# Altium schematic sheet MCU.SchDoc: Master Controller Unit (MCU)
size 431 x 279 mm; DocumentNumber: BMC-125-5321; Revision: A; SheetNumber: 5; SheetTotal: 6
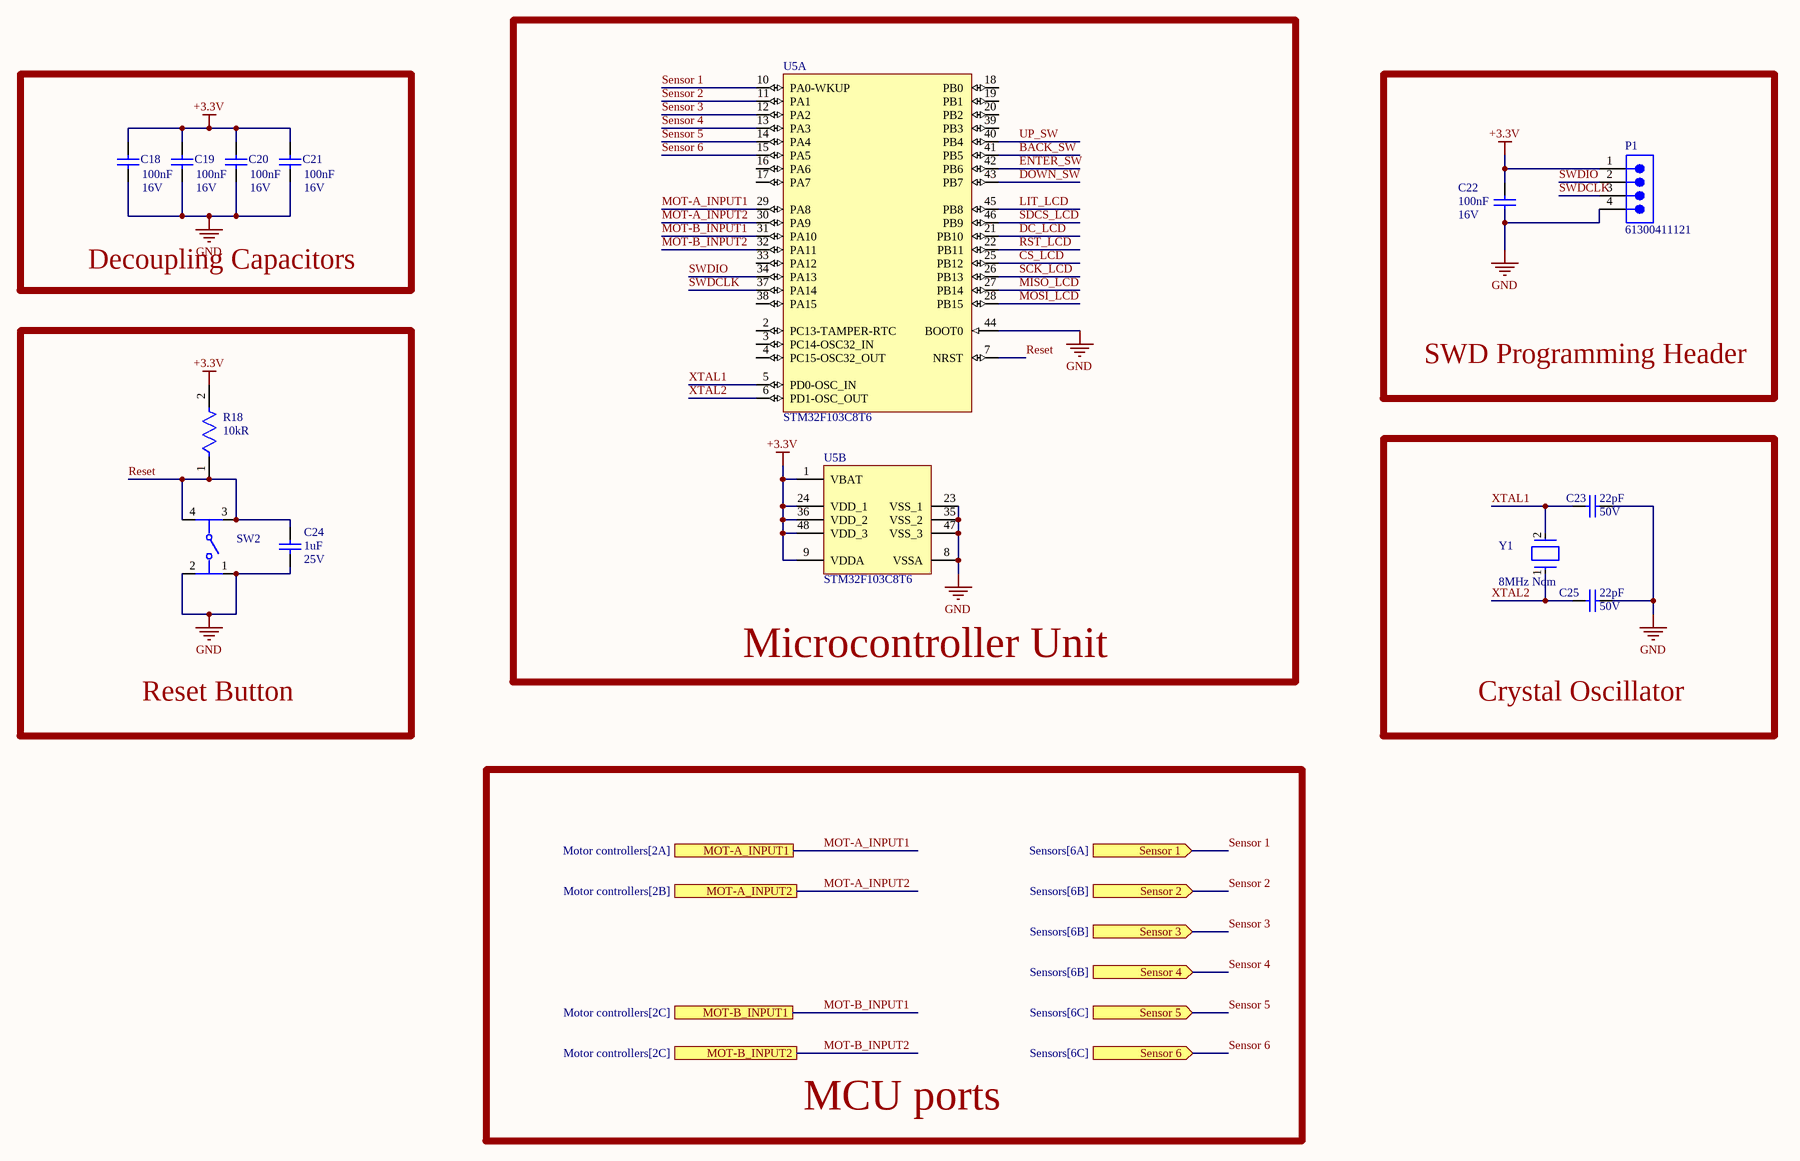
[diagram p0: MCU.SchDoc]

## Parts
C18  value 100nF  Rated DC Voltage (URdc): 16V  [CAPC1608X90X35LL15T15]  (hidden comment: 0.1uF 16V 0603)
C19  value 100nF  Rated DC Voltage (URdc): 16V  [CAPC1608X90X35LL15T15]  (hidden comment: 0.1uF 16V 0603)
C20  value 100nF  Rated DC Voltage (URdc): 16V  [CAPC1608X90X35LL15T15]  (hidden comment: 0.1uF 16V 0603)
C21  value 100nF  Rated DC Voltage (URdc): 16V  [CAPC1608X90X35LL15T15]  (hidden comment: 0.1uF 16V 0603)
C22  value 100nF  Rated DC Voltage (URdc): 16V  [CAPC1608X90X35LL15T15]  (hidden comment: 0.1uF 16V 0603)
C23  value 22pF  Voltage Rating: 50V  [FP-C0603C-CF-IPC_B]  (hidden comment: 22pF 50V 0603)
C24  value 1uF  Rated DC Voltage (URdc): 25V  [FP-CC0603-DA-IPC_B]  (hidden comment: 1uF 25V 0603)
C25  value 22pF  Voltage Rating: 50V  [FP-C0603C-CF-IPC_B]  (hidden comment: 22pF 50V 0603)
P1  61300411121  [61300411121]
R18  value 10kR  [RESC1608X55X25ML10T15]  (hidden comment: 10KOhm 0603)
SW2  PTS645SM43SMTR92LFS  [FP-PTS645SM43SMTR92LFS-MFG]  (value not drawn)
U5  STM32F103C8T6  [STM-LQFP48_M]  (parts A,B of 2)
Y1  ABLS2-8.000MHZ-D4Y-T  [FP-ABLS2-MFG]  (value not drawn)

## Blocks framed on the sheet
Microcontroller Unit: U5
Decoupling Capacitors: C18-C21
SWD Programming Header: C22 P1
Reset Button: C24 R18 SW2
Crystal Oscillator: C23 C25 Y1

## Ports
MOT-A_INPUT1 (see Motor controllers[2A]), MOT-A_INPUT2 (see Motor controllers[2B]), MOT-B_INPUT1 (see Motor controllers[2C]), MOT-B_INPUT2 (see Motor controllers[2C]), Sensor 1 (in, see Sensors[6A]), Sensor 2 (in, see Sensors[6B]), Sensor 3 (in, see Sensors[6B]), Sensor 4 (in, see Sensors[6B]), Sensor 5 (in, see Sensors[6C]), Sensor 6 (in, see Sensors[6C])

## Nets
+3.3V: C18.2 C19.2 C20.2 C21.2 C22.2 P1.1 R18.2 U5.1(VBAT) U5.9(VDDA) U5.24(VDD_1) U5.36(VDD_2) U5.48(VDD_3)
GND: C18.1 C19.1 C20.1 C21.1 C22.1 C23.1 C24.1 C25.1 P1.4 SW2.1 SW2.2 U5.8(VSSA) U5.23(VSS_1) U5.35(VSS_2) U5.44(BOOT0) U5.47(VSS_3)
BACK_SW: U5.41(PB5)
CS_LCD: U5.25(PB12)
DC_LCD: U5.21(PB10)
DOWN_SW: U5.43(PB7)
ENTER_SW: U5.42(PB6)
LIT_LCD: U5.45(PB8)
MISO_LCD: U5.27(PB14)
MOSI_LCD: U5.28(PB15)
MOT-A_INPUT1: U5.29(PA8) ; port MOT-A_INPUT1
MOT-A_INPUT2: U5.30(PA9) ; port MOT-A_INPUT2
MOT-B_INPUT1: U5.31(PA10) ; port MOT-B_INPUT1
MOT-B_INPUT2: U5.32(PA11) ; port MOT-B_INPUT2
Reset: C24.2 R18.1 SW2.3 SW2.4 U5.7(NRST)
RST_LCD: U5.22(PB11)
SCK_LCD: U5.26(PB13)
SDCS_LCD: U5.46(PB9)
Sensor 1: U5.10(PA0-WKUP) ; port Sensor 1
Sensor 2: U5.11(PA1) ; port Sensor 2
Sensor 3: U5.12(PA2) ; port Sensor 3
Sensor 4: U5.13(PA3) ; port Sensor 4
Sensor 5: U5.14(PA4) ; port Sensor 5
Sensor 6: U5.15(PA5) ; port Sensor 6
SWDCLK: P1.3 U5.37(PA14)
SWDIO: P1.2 U5.34(PA13)
UP_SW: U5.40(PB4)
XTAL1: C23.2 U5.5(PD0-OSC_IN) Y1.2
XTAL2: C25.2 U5.6(PD1-OSC_OUT) Y1.1

Not connected (* = marked no-connect by the designer): U5 2(PC13-TAMPER-RTC) 3(PC14-OSC32_IN) 4(PC15-OSC32_OUT) 16(PA6) 17(PA7) 18(PB0) 19(PB1) 20(PB2) 33(PA12) 38(PA15) 39(PB3)

## Notes on the sheet
- MCU ports
- 4
- 3
- DWG NO.
- REV
- 2
- 1
- ALL INFORMATION IN THIS DRAWING IS THE PROPERTY OF EMAC, AND CANNOT BE COPIED OR USED WITHOUT THE WRITTEN APPROVAL OF EMAC.
- D
- C
- B
- 2025 Bright Manufacturing Challenge
- SCHEMATIC
- A
- SIZE
- CODE IDENT
- 0BJZ8
- NONE
- SCALE
- WEIGHT
- NA
- SHEET
- OF
- REV. A, 06/21/2025
- FORM #PDE-0001-0001

## Library data of the parts
C18-C22 = CMP-00000-2: Ceramic Capacitor, Multilayer, Ceramic, 16V, 10% +Tol, 10% -Tol, X7R, 15% TC, 0.1uF, Surface Mount, 0603; Multilayer: Yes; Reference Standard: AEC-Q200; Height: 0.9mm; Capacitor Type: Ceramic; Case/Package: 0603; Dielectric Material: Ceramic; JESD-609 Code: e3; Length: 1.6mm; Max Operating Temperature: 125°C; Min Operating Temperature: -55°C; Mounting Technology: Surface Mount; Package Shape: Rectangular; Package Style: SMTMeter; Packaging: Tape and Reel; Pins: 2; Reach SVHC Compliant: Yes; RoHS Compliant: Yes; Temperature Characteristics Code: X7R; Terminal Finish: Nickel; Termination: Wraparound; Tolerance  (fill in as +-): 10%; Tolerance (fill in as +-): 10%; Width: 0.81mm
C23 C25 = CMP-00009-2: Ceramic Capacitor, Multilayer, Ceramic, 50V, 5% +Tol, 5% -Tol, C0G, 30ppm/Cel TC, 0.000022uF, Surface Mount, 0603; Multilayer: Yes; Height: 0.8mm; Capacitor Type: Ceramic; Case/Package: 0603; Dielectric Material: Ceramic; JESD-609 Code: e3; Length: 1.6mm; Max Operating Temperature: 125°C; Min Operating Temperature: -55°C; Mounting Technology: Surface Mount; Package Shape: Rectangular; Package Style: SMTMeter; Packaging: Tape and Reel; Pins: 2; Rated DC Voltage (URdc): 50V; Reach SVHC Compliant: Yes; RoHS Compliant: Yes; Temperature Characteristics Code: C0G; Terminal Finish: Nickel; Termination: Wraparound; Tolerance  (fill in as +-): 5%; Tolerance (fill in as +-): 5%; Width: 0.8mm
C24 = CMP-00002-5: Ceramic Capacitor, Multilayer, Ceramic, 25V, 10% +Tol, 10% -Tol, X5R, 15% TC, 1uF, Surface Mount, 0603; Multilayer: Yes; Height: 0.8mm; Capacitor Type: Ceramic; Case/Package: 0603; Dielectric Material: Ceramic; JESD-609 Code: e3; Length: 1.6mm; Max Operating Temperature: 85°C; Min Operating Temperature: -55°C; Mounting Technology: Surface Mount; Package Shape: Rectangular; Package Style: SMTMeter; Packaging: Tape and Reel; Pins: 2; Reach SVHC Compliant: Yes; RoHS Compliant: Yes; Temperature Characteristics Code: X5R; Terminal Finish: Nickel; Termination: Wraparound; Tolerance  (fill in as +-): 10%; Tolerance (fill in as +-): 10%; Width: 0.8mm; Voltage Rating: 25V
P1 = CMP-00013-1: Board Connector, 4 Contact(s), 1 Row(s), Male, Straight, 0.1 inch Pitch, Solder Terminal, Locking, Black Insulator, Plug; Contact Resistance: 20mR; Number of Contacts: 4; Body Length: 0.4inch; Contact Pattern: RECTANGULAR; Contact Style: SQ PIN-SKT; Dielectric Withstanding Voltage (AC): 500V; Insulation Resistance: 1GR; Number Of Connectors: 1; Rated Current (Signal): 3A; Reference Standard: UL; Reliability: COMMERCIAL; Termination: Solder; Min Operating Temperature: -40°C; Connector Type: BOARD CONNECTOR; Max Operating Temperature: 125°C; Contact Material: Copper Alloy; Body/Shell Style: PLUG; Body Breadth: 0.1inch; Body Depth: 0.1inch; Contact Finish - Mating: GOLD; Contact Finish - Termination: Gold (Au) - with Nickel (Ni) barrier; Contact Gender: Male; Insulation Color: Black; Insulation Material: Polybutylene; JESD-609 Code: e4; Mating Contact Pitch: 0.1inch; Mounting Option 1: LOCKING; Mounting Style: STRAIGHT; Mounting Technology: Board; Number of Rows Loaded: 1; PCB Contact Pattern: RECTANGULAR; Reach SVHC Compliant: Yes; RoHS Compliant: Yes; Terminal Length: 0.118inch; Terminal Pitch: 2.54mm
R18 = CMP-00018-1: Fixed Resistor, Metal Glaze/thick Film, 0.1W, 10000ohm, 75V, 5% +/-Tol, 100ppm/Cel, Surface Mount, 0603; Additional Feature: LASER TRIMMABLE; Package Height: 0.45mm; Package Length: 1.6mm; Package Width: 0.8mm; Power: 100mW; Rated Temperature: 70°C; Temperature Coefficient (ppm/Cel): 100; Packaging: Tape and Reel; Tolerance: 5%; Case/Package: 0603; Construction: Chip; JESD-609 Code: e3; Max Operating Temperature: 155°C; Min Operating Temperature: -55°C; Mounting Technology: Surface Mount; Package Shape: Rectangular; Pins: 2; Reach SVHC Compliant: Yes; Resistor Type: FIXED RESISTOR; RoHS Compliant: Yes; Technology: METAL GLAZE/THICK FILM; Terminal Finish: Nickel; Termination: Wraparound; Working Voltage: 75V
SW2 = CMP-00020-2: Keypad Switch, 1 Switches, SPST, Momentary-tactile, 0.05A, 12VDC, 1.57N, 4 PCB Hole Cnt, Solder Terminal, Surface Mount-straight; Contact Resistance: 0.1mR; Actuator Type: Pushbutton; Body Breadth: 5.9944mm; Body Height: 3.4544mm; Contact Current(DC)-Max: 50mA; Contact DC Max Rating R Load: 0.05A@12VDC; Contact Voltage(DC)-Max: 12V; Dielectric Withstand Volts: 250VACV; Insulation Resistance: 100GR; PCB Hole Count: 4; Min Operating Temperature: -20°C; Termination: Solder; Switch Function: SPST; Max Operating Temperature: 60°C; Body Length or Diameter: 5.9944mm; JESD-609 Code: e4; Mounting Technology: Surface Mount; Reach SVHC Compliant: Yes; RoHS Compliant: Yes; Switch Action: MOMENTARY; Switch Type: Keypad; Terminal Finish: Silver; Terminal Length: 0.138inch
U5 = CMP-00023-5: RISC Microcontroller, 32-Bit, FLASH, STM32 CPU, 72MHz, CMOS, PQFP48; Clock Frequency: 16MHz; Interface: I2C,SPI,USB,CAN,USART; Max Supply Current: 50mA; Max Supply Voltage: 3.6V; Min Supply Voltage: 2V; Nominal Supply Voltage: 3.3V; Number of I/O Lines: 37; Package Body Material: Plastic; Package Equivalence Code: QFP48,.35SQ,20; Peripherals: POR,DMA; Power Supplies: 2.5/3.3; Qualification Status: Not Qualified; Time @ Peak Reflow Temperature-Max (s): 30s; Case/Package: LFQFP; Height - Seated (Max): 1.6mm; JESD-30 Code: S-PQFP-G48; JESD-609 Code: e4; Length: 7mm; Max Operating Temperature: 105°C; Min Operating Temperature: -40°C; Moisture Sensitivity Level: 2; Package Shape: Square; Peak Reflow Temperature (Cel): 260°C; Pins: 48; Reach SVHC Compliant: Yes; RoHS Compliant: Yes; Surface Mount: Yes; Technology: CMOS; Temperature Grade: INDUSTRIAL; Terminal Finish: Nickel; Terminal Form: Gull Wing; Terminal Pitch: 0.5mm; Terminal Position: QUAD; Width: 7mm
Y1 = CMP-00024-1: 8MHz Nom; Load Capacitance: 18pF; Frequency Tolerance: 30ppm; Frequency Stability: 0.003%; Aging: 5 PPM/FIRST YEAR; Crystal/Resonator Type: PARALLEL - FUNDAMENTAL; Drive Level: 100uW; ESR: 80R; Operating Frequency-Nom: 80; Min Operating Temperature: -40°C; RoHS Compliant: Yes; Max Operating Temperature: 85°C; JESD-609 Code: e3; Mounting Technology: Surface Mount; Reach SVHC Compliant: Yes; Terminal Finish: Tin; Operating Frequency: 8MHz Nom